# Altium schematic sheet BackPlane_connectors.SchDoc: =ProjectName
size 420 x 297 mm; Author: SBH; CompanyName: WUT; DrawnBy: SBH; Organization: ISE-WUT; Address1: Warsaw Univeristy of Technology; Address2: Nowowiejska 15/19; DocumentNumber: 4; Revision: -; SheetNumber: 4; SheetTotal: 12; EDA_Number: ARTIQ; Projet: eRTM15 Baikal; ModifiedBy: -; CreateDate: XX/XX/XXXX; CheckedDate: -; Title2: BackPlane_connectors.SchDoc; DivGrp: ISE; Designer: SBH; ModifiedDate: -; ProjectName: eRTM15 Baikal
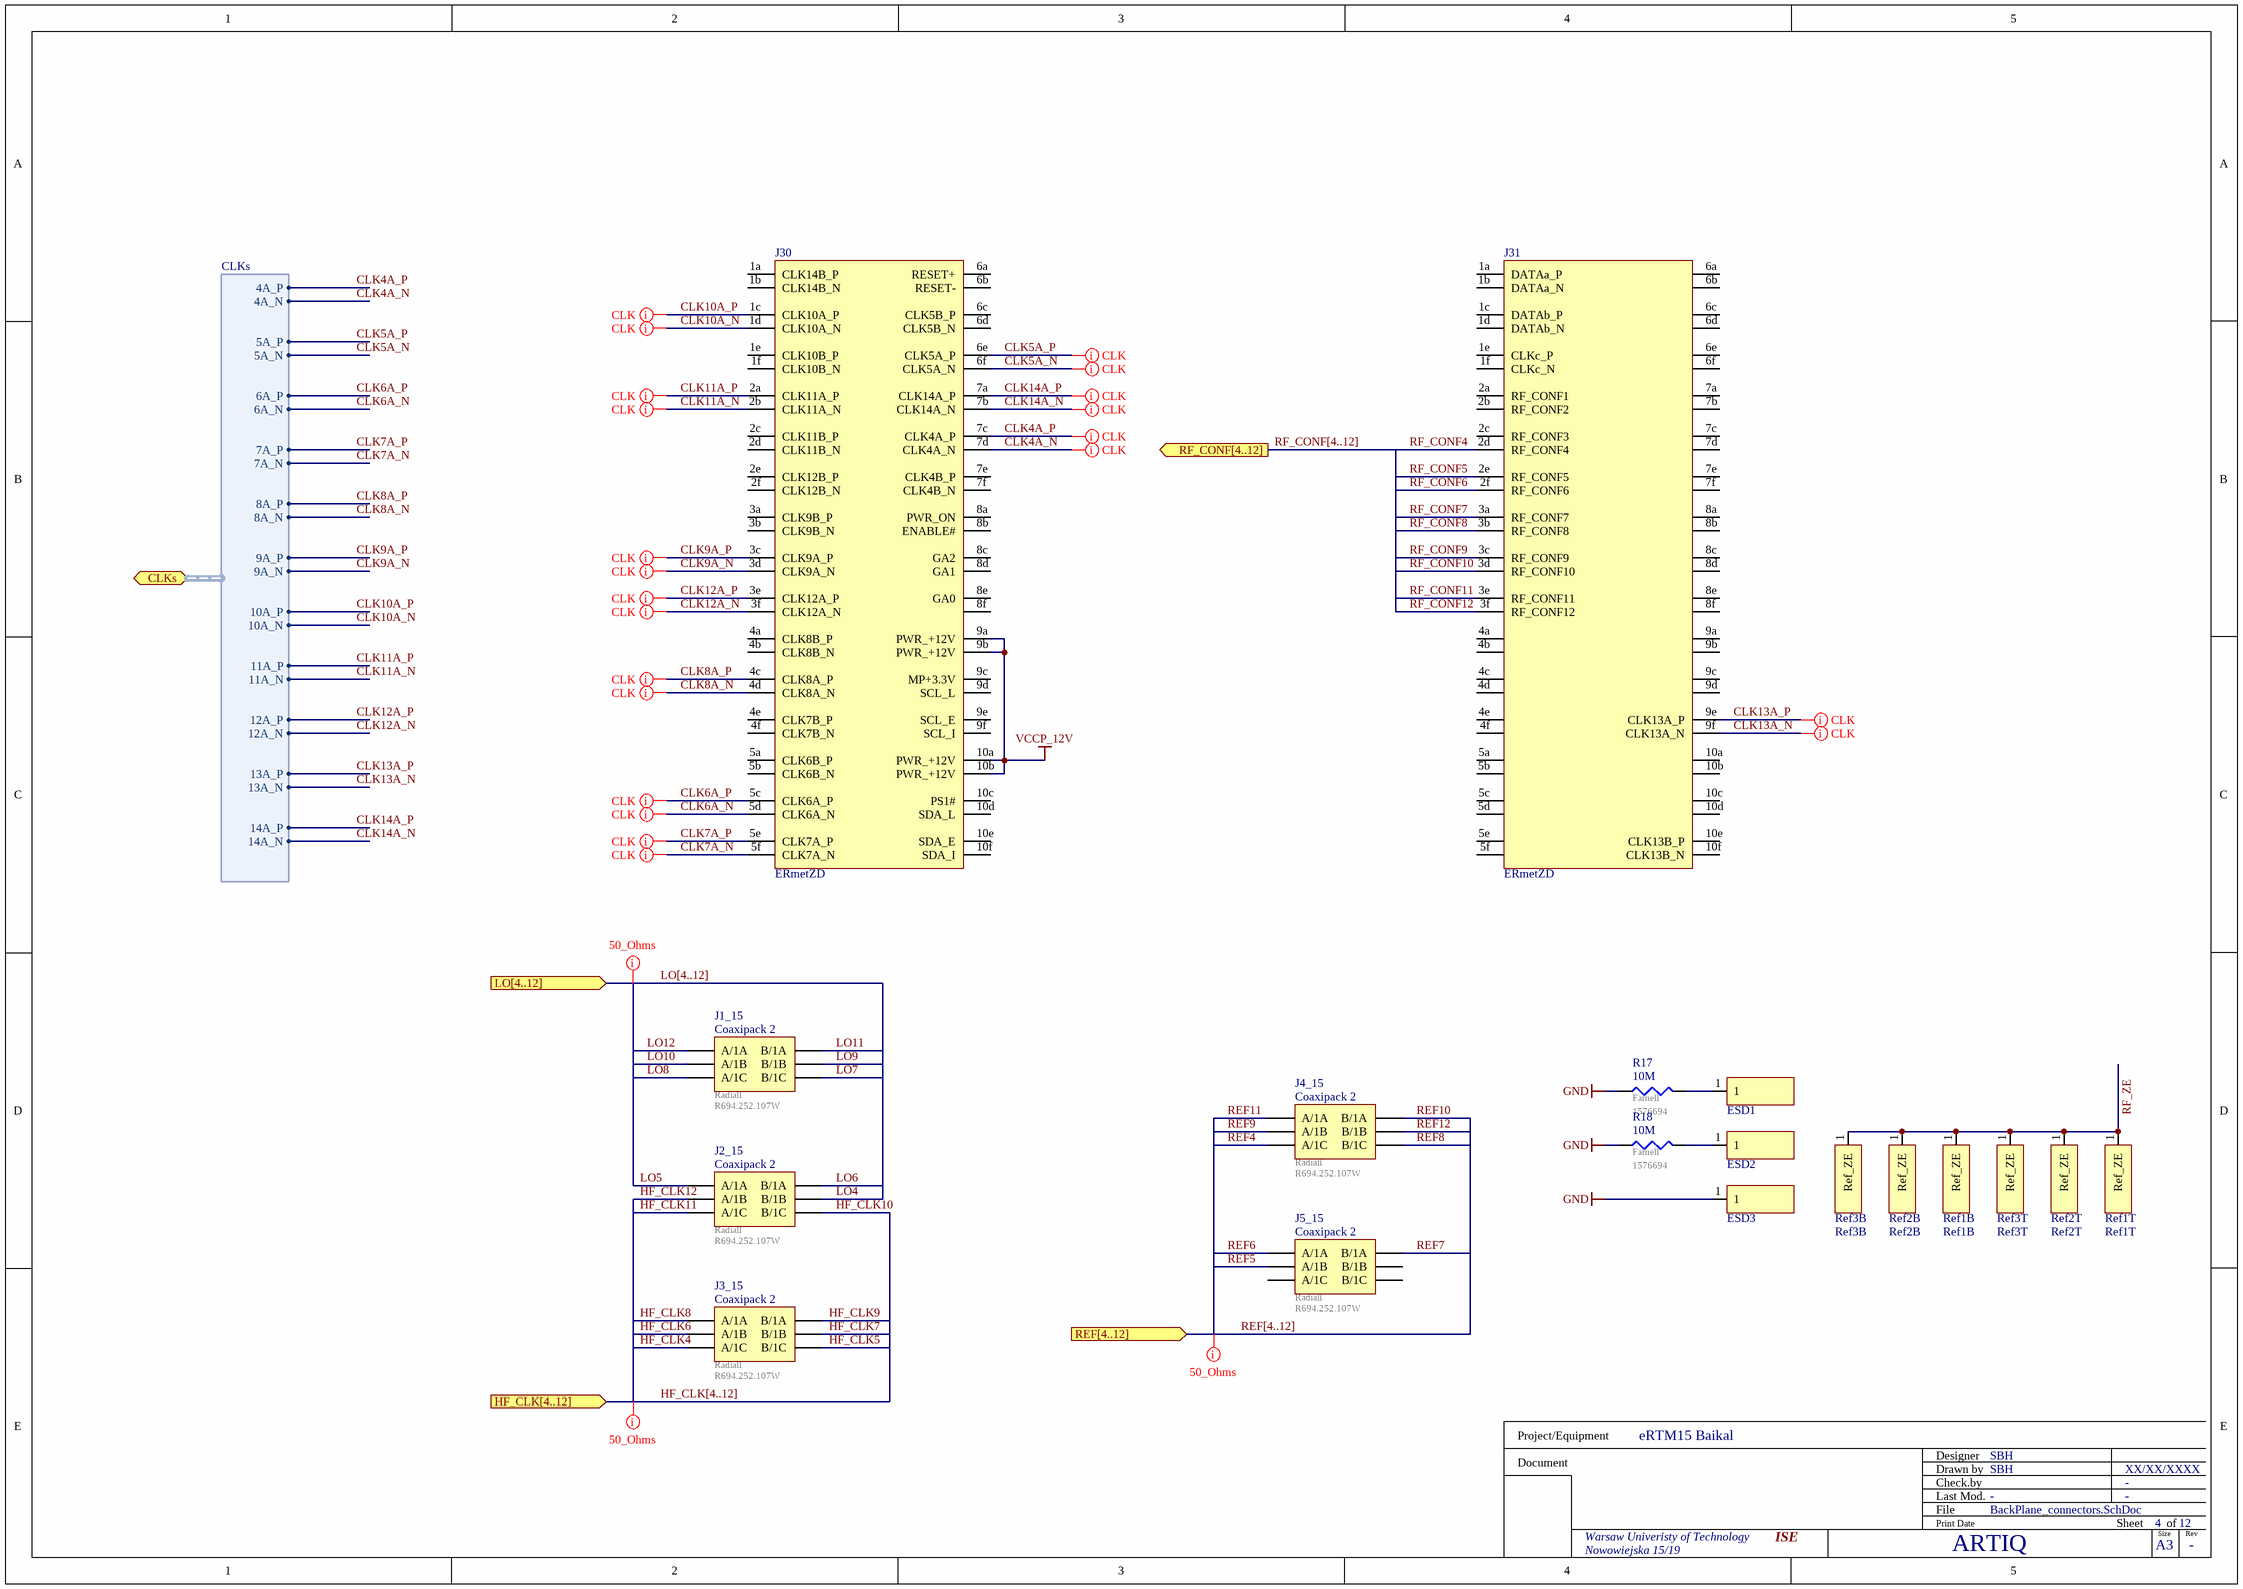
[diagram p0: BackPlane_connectors.SchDoc]

## Parts
ESD1  ESD  [ESD 1&2]  (value not drawn)
ESD2  ESD  [ESD 1&2]  (value not drawn)
ESD3  ESD  [ESD 3]  (value not drawn)
J1_15  value Coaxipack 2  Distributor: Radiall  DistributorNr: R694.252.107W  [Coaxipack2]  (hidden comment: CoaxiPack (Radiall))
J2_15  value Coaxipack 2  Distributor: Radiall  DistributorNr: R694.252.107W  [Coaxipack2]  (hidden comment: CoaxiPack (Radiall))
J3_15  value Coaxipack 2  Distributor: Radiall  DistributorNr: R694.252.107W  [Coaxipack2]  (hidden comment: CoaxiPack (Radiall))
J4_15  value Coaxipack 2  Distributor: Radiall  DistributorNr: R694.252.107W  [Coaxipack2]  (hidden comment: CoaxiPack (Radiall))
J5_15  value Coaxipack 2  Distributor: Radiall  DistributorNr: R694.252.107W  [Coaxipack2]  (hidden comment: CoaxiPack (Radiall))
J30  ERmetZD  [ERmet ZD 3-10 Connector 973028]
J31  ERmetZD  [ERmet ZD 3-10 Connector 973028]
R17  Distributor: Farnell  DistributorNr: 1576694  [1206_ZE]  (hidden comment: 10M)
R18  Distributor: Farnell  DistributorNr: 1576694  [1206_ZE]  (hidden comment: 10M)
Ref1B  Ref1B  [RefPad_1.5mm]
Ref1T  Ref1T  [RefPad_1.5mm]
Ref2B  Ref2B  [RefPad_1.5mm]
Ref2T  Ref2T  [RefPad_1.5mm]
Ref3B  Ref3B  [RefPad_1.5mm]
Ref3T  Ref3T  [RefPad_1.5mm]

## Ports
CLKs (harness CLKs), HF_CLK[4..12] (in), LO[4..12] (in), REF[4..12] (in), RF_CONF[4..12] (out)

## Harnesses
CLKs: 4A_P, 4A_N, 5A_P, 5A_N, 6A_P, 6A_N, 7A_P, 7A_N, 8A_P, 8A_N, 9A_P, 9A_N, 10A_P, 10A_N, 11A_P, 11A_N, 12A_P, 12A_N, 13A_P, 13A_N, 14A_P, 14A_N

## Nets
GND: ESD3.1 J1_15.0 J2_15.0 J3_15.0 J4_15.0 J5_15.0 J30.1ab(GND) J30.1cd(GND) J30.1ef(GND) J30.2ab(GND) J30.2cd(GND) J30.2ef(GND) J30.3ab(GND) J30.3cd(GND) J30.3ef(GND) J30.4ab(GND) J30.4cd(GND) J30.4ef(GND) J30.5ab(GND) J30.5cd(GND) J30.5ef(GND) J30.6ab(GND) J30.6cd(GND) J30.6ef(GND) J30.7ab(GND) J30.7cd(GND) J30.7ef(GND) J30.8ab(GND) J30.8cd(GND) J30.8ef(GND) J30.9ab(GND) J30.9cd(GND) J30.9ef(GND) J30.10ab(GND) J30.10cd(GND) J30.10ef(GND) J31.1ab(GND) J31.1cd(GND) J31.1ef(GND) J31.2ab(GND) J31.2cd(GND) J31.2ef(GND) J31.3ab(GND) J31.3cd(GND) J31.3ef(GND) J31.4ab(GND) J31.4cd(GND) J31.4ef(GND) J31.5ab(GND) J31.5cd(GND) J31.5ef(GND) J31.6ab(GND) J31.6cd(GND) J31.6ef(GND) J31.7ab(GND) J31.7cd(GND) J31.7ef(GND) J31.8ab(GND) J31.8cd(GND) J31.8ef(GND) J31.9ab(GND) J31.9cd(GND) J31.9ef(GND) J31.10ab(GND) J31.10cd(GND) J31.10ef(GND) R17.1 R18.1
VCCP_12V: J30.9a(PWR_+12V) J30.9b(PWR_+12V) J30.10a(PWR_+12V) J30.10b(PWR_+12V)
CLK4A_N: J30.7d(CLK4A_N) ; port CLKs.4A_N
CLK4A_P: J30.7c(CLK4A_P) ; port CLKs.4A_P
CLK5A_N: J30.6f(CLK5A_N) ; port CLKs.5A_N
CLK5A_P: J30.6e(CLK5A_P) ; port CLKs.5A_P
CLK6A_N: J30.5d(CLK6A_N) ; port CLKs.6A_N
CLK6A_P: J30.5c(CLK6A_P) ; port CLKs.6A_P
CLK7A_N: J30.5f(CLK7A_N) ; port CLKs.7A_N
CLK7A_P: J30.5e(CLK7A_P) ; port CLKs.7A_P
CLK8A_N: J30.4d(CLK8A_N) ; port CLKs.8A_N
CLK8A_P: J30.4c(CLK8A_P) ; port CLKs.8A_P
CLK9A_N: J30.3d(CLK9A_N) ; port CLKs.9A_N
CLK9A_P: J30.3c(CLK9A_P) ; port CLKs.9A_P
CLK10A_N: J30.1d(CLK10A_N) ; port CLKs.10A_N
CLK10A_P: J30.1c(CLK10A_P) ; port CLKs.10A_P
CLK11A_N: J30.2b(CLK11A_N) ; port CLKs.11A_N
CLK11A_P: J30.2a(CLK11A_P) ; port CLKs.11A_P
CLK12A_N: J30.3f(CLK12A_N) ; port CLKs.12A_N
CLK12A_P: J30.3e(CLK12A_P) ; port CLKs.12A_P
CLK13A_N: J31.9f(CLK13A_N) ; port CLKs.13A_N
CLK13A_P: J31.9e(CLK13A_P) ; port CLKs.13A_P
CLK14A_N: J30.7b(CLK14A_N) ; port CLKs.14A_N
CLK14A_P: J30.7a(CLK14A_P) ; port CLKs.14A_P
HF_CLK4: J3_15.A/1C
HF_CLK5: J3_15.B/1C
HF_CLK6: J3_15.A/1B
HF_CLK7: J3_15.B/1B
HF_CLK8: J3_15.A/1A
HF_CLK9: J3_15.B/1A
HF_CLK10: J2_15.B/1C
HF_CLK11: J2_15.A/1C
HF_CLK12: J2_15.A/1B
LO4: J2_15.B/1B
LO5: J2_15.A/1A
LO6: J2_15.B/1A
LO7: J1_15.B/1C
LO8: J1_15.A/1C
LO9: J1_15.B/1B
LO10: J1_15.A/1B
LO11: J1_15.B/1A
LO12: J1_15.A/1A
REF4: J4_15.A/1C
REF5: J5_15.A/1B
REF6: J5_15.A/1A
REF7: J5_15.B/1A
REF8: J4_15.B/1C
REF9: J4_15.A/1B
REF10: J4_15.B/1A
REF11: J4_15.A/1A
REF12: J4_15.B/1B
RF_CONF4: J31.2d(RF_CONF4)
RF_CONF5: J31.2e(RF_CONF5)
RF_CONF6: J31.2f(RF_CONF6)
RF_CONF7: J31.3a(RF_CONF7)
RF_CONF8: J31.3b(RF_CONF8)
RF_CONF9: J31.3c(RF_CONF9)
RF_CONF10: J31.3d(RF_CONF10)
RF_CONF11: J31.3e(RF_CONF11)
RF_CONF12: J31.3f(RF_CONF12)
RF_ZE: Ref1B.1(Ref_ZE) Ref1T.1(Ref_ZE) Ref2B.1(Ref_ZE) Ref2T.1(Ref_ZE) Ref3B.1(Ref_ZE) Ref3T.1(Ref_ZE)
NetESD1_1: ESD1.1 R17.2
NetESD2_1: ESD2.1 R18.2

Not connected (* = marked no-connect by the designer): J5_15 A/1C B/1B B/1C; J30 1a(CLK14B_P) 1b(CLK14B_N) 1e(CLK10B_P) 1f(CLK10B_N) 2c(CLK11B_P) 2d(CLK11B_N) 2e(CLK12B_P) 2f(CLK12B_N) 3a(CLK9B_P) 3b(CLK9B_N) 4a(CLK8B_P) 4b(CLK8B_N) 4e(CLK7B_P) 4f(CLK7B_N) 5a(CLK6B_P) 5b(CLK6B_N) 6a(RESET+) 6b(RESET-) 6c(CLK5B_P) 6d(CLK5B_N) 7e(CLK4B_P) 7f(CLK4B_N) 8a(PWR_ON) 8b(ENABLE#) 8c(GA2) 8d(GA1) 8e(GA0) 8f 9c(MP+3.3V) 9d(SCL_L) 9e(SCL_E) 9f(SCL_I) 10c(PS1#) 10d(SDA_L) 10e(SDA_E) 10f(SDA_I); J31 1a(DATAa_P) 1b(DATAa_N) 1c(DATAb_P) 1d(DATAb_N) 1e(CLKc_P) 1f(CLKc_N) 2a(RF_CONF1) 2b(RF_CONF2) 2c(RF_CONF3) 4a 4b 4c 4d 4e 4f 5a 5b 5c 5d 5e 5f 6a 6b 6c 6d 6e 6f 7a 7b 7c 7d 7e 7f 8a 8b 8c 8d 8e 8f 9a 9b 9c 9d 10a 10b 10c 10d 10e(CLK13B_P) 10f(CLK13B_N)

## Buses and harness runs
bus HF_CLK[4..12] = port HF_CLK[4..12]
bus LO[4..12] = port LO[4..12]
bus REF[4..12] = port REF[4..12]
bus RF_CONF[4..12] = port RF_CONF[4..12]

## Layout directives
differential pair: CLK4A_N, CLK4A_P, CLK5A_N, CLK5A_P, CLK6A_N, CLK6A_P, CLK7A_N, CLK7A_P, CLK8A_N, CLK8A_P, CLK9A_N, CLK9A_P, CLK10A_N, CLK10A_P, CLK11A_N, CLK11A_P, CLK12A_N, CLK12A_P, CLK13A_N, CLK13A_P, CLK14A_N, CLK14A_P
net class 50_Ohms: (no net found under the mark)

## Notes on the sheet
- Project/Equipment
- Document
- Designer
- Drawn by
- Check.by
- File
- Last Mod.
- Print Date
- Sheet
- Size
- A3
- of
- Rev

## Library data of the parts
ESD1-ESD3 = ESD: ESD Strip
J30 = ERmetZD 3-10 Connector 1: Zone3 Backplane Connector - eRTM15 J30; ManufacturerNr: 973028; Manufacturer: ERNI; Distributor: ERNI; DistributorNr: 973028; Type: THT; Value: *; Package: *
J31 = ERmetZD 3-10 Connector 2: Zone3 Backplane Connector - eRTM15 J31; Manufacturer: ERNI; ManufacturerNr: 973028; Distributor: ERNI; DistributorNr: 973028; Type: THT
R17 R18 = Res3: Resistor; ManufacturerNr: MCHP06W2F1005T5E; Manufacturer: MULTICOMP; Power: 0.5W; Temp. Coeff.: 100ppm; Voltage: 50V; Value: 10M; Type: SMT; Package: 1206
Ref1B Ref1T Ref2B Ref2T Ref3B Ref3T = Ref_Pad: Reference Pad for SMD assembling; Package: RefPad_1.5mm
  Ref1B: Value: Ref1B
  Ref1T: Value: Ref1T
  Ref2B: Value: Ref2B
  Ref2T: Value: Ref2T
  Ref3B: Value: Ref3B
  Ref3T: Value: Ref3T
J1_15 J2_15 J3_15 J4_15 J5_15 = CoaxiPack (Radiall): Manufacturer: Radiall; ManufacturerNr: R694.252.107W